# Altium schematic sheet usb.SchDoc
size A3
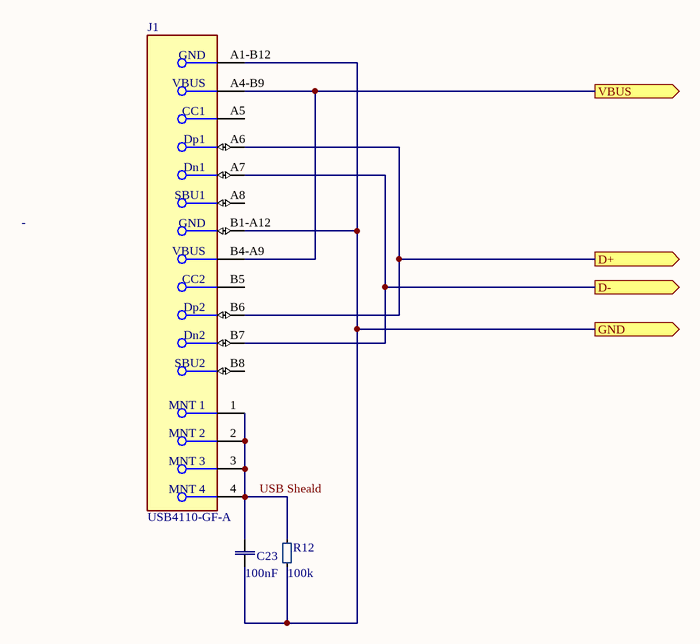
[diagram p0: usb.SchDoc]

## Parts
C23  Capacitance: 100nF  [cap0402]  (hidden comment: GRM155R71H104ME14D)
J1  USB4110-GF-A  [FP-USB4110-GF-A-MFG]
R12  Resistance: 100k  [SMD_0402(1005)_M]  (hidden comment: RC0402FR-07100KL)

## Ports
D+ (out), D- (out), GND (out), VBUS (out)

## Nets
D+: J1.A6(Dp1) J1.B6(Dp2) ; port D+
D-: J1.A7(Dn1) J1.B7(Dn2) ; port D-
GND: C23.1 J1.A1-B12(GND) J1.B1-A12(GND) R12.1 ; port GND
USB Sheald: C23.2 J1.1(MNT_1) J1.2(MNT_2) J1.3(MNT_3) J1.4(MNT_4) R12.2
VBUS: J1.A4-B9(VBUS) J1.B4-A9(VBUS) ; port VBUS

Not connected (* = marked no-connect by the designer): J1 A5(CC1) A8(SBU1) B5(CC2) B8(SBU2)

## Notes on the sheet
- -

## Library data of the parts
C23 = CMP-0001-00001-10: 0402 0.1 uF 50 V ±20% Tolerance X7R SMT Monolithic Ceramic Chip Capacitor; Value: 100nF; Voltage Rating: 50V; Length: 0.039inch; Packaging: Cut Tape; Max Operating Temperature: 125°C; Min Operating Temperature: -55°C; Mount: Surface Mount; Case/Package: 0402; Tolerance: 20%; Width: 0.02inch; Capacitor Type: Ceramic; Thickness: 0.022inch; Pins: 2; RoHS: Yes; LCSC Part#: C182412
J1 = CMP-ROOT-00018-6: Conn Usb 2.0 Type-c R/a SMT; Number of Positions: 12; System: Connector; RoHS: Yes; Mount: TH; LCSC Part#: -
R12 = CMP-0001-00006-6: Res General Purpose Thick Film 0402 100K Ohm 1% 1/16W ±100ppm/°C Molded SMD Paper T/R; Max Power Dissipation: 63mW; Voltage Rating: 50V; Value: 100k; Termination: SMD/SMT; Tolerance: 1%; Length: 0.039inch; REACH SVHC: No SVHC; Features: Moisture Resistant; Mount: SMD; Power Rating: 63mW; Depth: 0.5mm; Max Operating Temperature: 155°C; Width: 0.02inch; Height: 0.016inch; Case Code (Metric): 1005; Temperature Coefficient: 100ppm/°C; Military Standard: Not; Case/Package: 0402; Lead Free: Lead Free; Working Voltage: 50V; Package Quantity: 1; Number of Terminations: 2; Min Operating Temperature: -55°C; Composition: Thick Film; RoHS: Yes; Packaging: Tape and Reel; Case Code (Imperial): 0402; LCSC Part#: C60491